# Altium schematic sheet HV_Detection.SchDoc
size A4; SheetNumber: 2; SheetTotal: 4
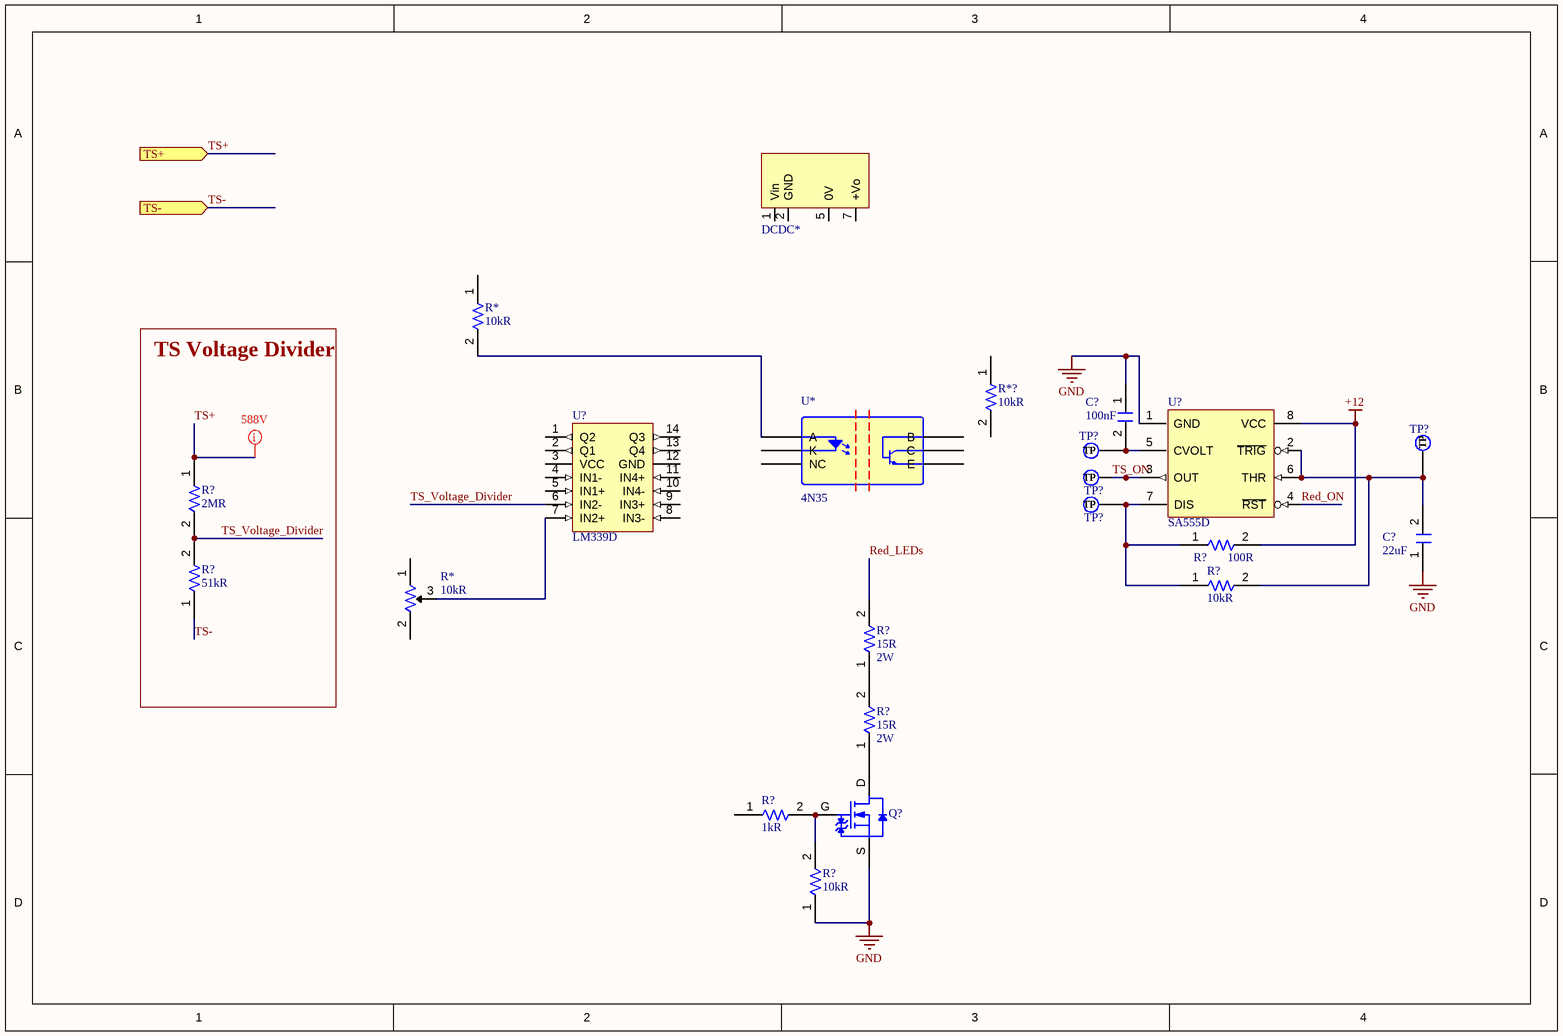
[diagram p0: HV_Detection.SchDoc]

## Parts
(Parts that share a designator on the sheet are numbered #1, #2 ... from top to bottom, then left to right.)
C?#1  Capacitance: 100nF  [C0805FNPC-R]  (hidden comment: 885012207098)
C?#2  Capacitance: 22uF  [C0805FNPC-W]  (hidden comment: 885012107011)
DCDC*  F1205S-1W  (value not drawn)
Q?  IRFR3410PbF  [TRT-NCH-D2PAK]  (value not drawn)
R*#1  Resistance: 10kR  [R1206FTK-W]  (hidden comment: CRCW120610K0FKEA)
R*#2  Resistance: 10kR  [R10k-VTR]  (hidden comment: 3296W-1-103LF)
R*?  Resistance: 10kR  [R1206FTK-W]  (hidden comment: CRCW120610K0FKEA)
R?#1  Resistance: 2MR  [R2512FTK]  (hidden comment: R2M-2512FTK)
R?#2  Resistance: 100R  [R0805FTK]  (hidden comment: CR0805-FX-1000ELF)
R?#3  Resistance: 10kR  [R0805FTK]  (hidden comment: CR0805-JW-103ELF)
R?#4  Resistance: 51kR  [R1206FTK-W]  (hidden comment: CRCW120610K0FKEA)
R?#5  value 15R  Max Power Dissipation: 2W  [R2512FTK]  (hidden comment: 352115RFT)
R?#6  value 15R  Max Power Dissipation: 2W  [R2512FTK]  (hidden comment: 352115RFT)
R?#7  Resistance: 1kR  [R0805FTK]  (hidden comment: CR0805-JW-102ELF)
R?#8  Resistance: 10kR  [R0805FTK]  (hidden comment: CR0805-JW-103ELF)
TP?#1  TestPoint  [TestPoint]  (value not drawn)  (no BOM)
TP?#2  TestPoint  [TestPoint]  (value not drawn)  (no BOM)
TP?#3  TestPoint  [TestPoint]  (value not drawn)  (no BOM)
TP?#4  TestPoint  [TestPoint]  (value not drawn)  (no BOM)
U*  4N35  [Optocoupler_4N35]
U?#1  LM339D  [Array_4_Amp_LM339D]
U?#2  Manufacturer Part Number: SA555D  [Timer_SA555]  (hidden comment: SA555)

## Blocks framed on the sheet
TS Voltage Divider: R?#1 R?#4

## Ports
TS+ (in), TS- (in)

## Nets
+12: R?#2.2 U?#2.8(VCC)
GND: C?#1.1 C?#2.1 Q?.S R?#8.1 U?#2.1(GND)
Red_LEDs: R?#5.2
Red_ON: U?#2.4(~{RST})
TS+: R?#1.1 ; port TS+
TS-: R?#4.1 ; port TS-
TS_ON: TP?#2.1(TP) U?#2.3(OUT)
TS_Voltage_Divider: R?#1.2 R?#4.2 U?#1.6(IN2-)
NetC?#1_2: C?#1.2 TP?#1.1(TP) U?#2.5(CVOLT)
NetC?#2_2: C?#2.2 R?#3.2 TP?#3.1(TP) U?#2.2(~{TRIG}) U?#2.6(THR)
NetQ?_D: Q?.D R?#6.1
NetQ?_G: Q?.G R?#7.2 R?#8.2
NetR*#1_2: R*#1.2 U*.1(A)
NetR*#2_3: R*#2.3 U?#1.7(IN2+)
NetR?#2_1: R?#2.1 R?#3.1 TP?#4.1(TP) U?#2.7(DIS)
NetR?#5_1: R?#5.1 R?#6.2

Not connected (* = marked no-connect by the designer): DCDC* 1(Vin) 2(GND) 5(0V) 7(+Vo); R*#1 1; R*#2 1(2) 2; R*? 1 2; R?#7 1; U* 2(K) 3(NC) 4(E) 5(C) 6(B); U?#1 1(Q2) 2(Q1) 3(VCC) 4(IN1-) 5(IN1+) 8(IN3-) 9(IN3+) 10(IN4-) 11(IN4+) 12(GND) 13(Q4) 14(Q3)

## Layout directives
mark named 588V: TS+

## Library data of the parts
C?#1 = C100n-50V-0805FNPC-X7R: Cap, 0.1ΜF, 50V, 10%, X7R, 0805; Manufacturer 1: Wurth Electronics; .Creator: DR; Supplier 1: RSComponents; Manufacturer Part Number 1: 885012207098; RoHS: Yes; Category: Ceramic Capacitors; Stock 1: 8000; Pricing 1: 100=0,10200, 500=0,07100, 2000=0,06100 (GBP); Mount: Surface Mount; Case/Package: 0805; Case Code (Metric): 2012; Case Code (Imperial): 0805; Min Operating Temperature: -55°C; Max Operating Temperature: 125°C; Packaging: Cut Tape; Voltage Rating: 50V; Dielectric: X7R; Tolerance: 10%; Voltage Rating (DC): 50V; Length: 0.079inch; Width: 0.049inch; Thickness: 0.035inch; REACH SVHC: Unknown; RoHS Compliant: Yes; ComponentLink1URL: http://www.farnell.com/datasheets/1958498.pdf?src-supplier=Farnell; ComponentLink1Description: http://www.farnell.com/datasheets/1958498.pdf?src-supplier=Farnell; ComponentLink2URL: http://www.farnell.com/datasheets/1958498.pdf?src-supplier=Element14; ComponentLink2Description: http://www.farnell.com/datasheets/1958498.pdf?src-supplier=Element14; ComponentLink3URL: https://katalog.we-online.de/pbs/datasheet/885012207098.pdf?src-supplier=Digi-Key; ComponentLink3Description: https://katalog.we-online.de/pbs/datasheet/885012207098.pdf?src-supplier=Digi-Key; ComponentLink4URL: http://www.farnell.com/datasheets/1958498.pdf?src-supplier=Newark; ComponentLink4Description: http://www.farnell.com/datasheets/1958498.pdf?src-supplier=Newark; Supplier Part Number 1: 1813493
C?#2 = C22u-10V-0805FNPC-X5R: Multilayer Ceramic Capacitor, Wcap-Csgp Series, 22 F, 20%, X5R, 10 V, 0805 [2012 Metric] Rohs Compliant: Yes; Manufacturer: Wurth Electronics; Voltage Rating: 10V; .Creator: DR; Supplier 1: RSComponents; Manufacturer Part Number: 885012107011; RoHS: Yes; Category: Ceramic Capacitors; Stock 1: 8800; Pricing 1: 20=0,15300, 100=0,40300, 200=0,37700, 500=0,35100, 1000=0,31700 (GBP); Mount: Surface Mount; Case/Package: 0805; Case Code (Metric): 2012; Case Code (Imperial): 0805; Min Operating Temperature: -55°C; Max Operating Temperature: 85°C; Packaging: Cut Tape; Dielectric: X5R; Tolerance: 20%; Voltage Rating (DC): 10V; Length: 0.079inch; Width: 0.049inch; Thickness: 0.057inch; REACH SVHC: Unknown; RoHS Compliant: Yes; ComponentLink1URL: http://www.farnell.com/datasheets/1958453.pdf?src-supplier=Farnell; ComponentLink1Description: http://www.farnell.com/datasheets/1958453.pdf?src-supplier=Farnell; ComponentLink2URL: http://www.farnell.com/datasheets/1958453.pdf?src-supplier=Newark; ComponentLink2Description: http://www.farnell.com/datasheets/1958453.pdf?src-supplier=Newark; ComponentLink3URL: http://www.farnell.com/datasheets/1958453.pdf?src-supplier=Element14; ComponentLink3Description: http://www.farnell.com/datasheets/1958453.pdf?src-supplier=Element14; ComponentLink4URL: https://katalog.we-online.de/pbs/datasheet/885012107011.pdf?src-supplier=Digi-Key; ComponentLink4Description: https://katalog.we-online.de/pbs/datasheet/885012107011.pdf?src-supplier=Digi-Key; Supplier Part Number 1: 1813507; ComponentLink5Description: Where buy it; ComponentLink5URL: https://www.we-online.com/catalog/en/WCAP-CSGP-10VDC#885012107011
DCDC* = DCDC-12V/5V-0.2A: 1W DCDC Converter 12V/5V, 3kVDC/1min, / SIP Package, -40°C to +85°C
Q? = TRT-NCH-31/100: MOSFET N-CH 100V 31A DPAK; Manufacturer 1: Infineon; Manufacturer Part Number 1: IRFR3410TRPBF; Power Dissipation: 110W; Gate to Source Voltage (Vgs): 20V; Rds On Max: 39mR; Input Capacitance: 1.69nF; Max Power Dissipation: 3W; Turn-Off Delay Time: 40ns; Turn-On Delay Time: 12ns; Threshold Voltage: 4V; Polarization: N; ComponentLink2Description: Datasheet; ComponentLink2URL: https://www.mouser.es/datasheet/2/427/sq2318bes-1868475.pdf; Supplier 1: Farnell; RoHS: Yes; Category: MOSFETs; Stock 1: 4070; Pricing 1: 1=1,20000, 10=1,08000, 100=0,84200, 500=0,69600 (EUR); Mount: Surface Mount; Case/Package: TO-252-3; Number of Pins: 3; Min Operating Temperature: -55°C; Max Operating Temperature: 175°C; Continuous Drain Current (ID): 31A; Packaging: Cut Tape; Drain to Source Voltage (Vdss): 100V; Drain to Source Resistance: 39mR; Drain to Source Breakdown Voltage: 100V; Series: HEXFET®; Max Dual Supply Voltage: 100V; Length: 0.264inch; Width: 0.245inch; Height: 0.094inch; Lead Free: Contains Lead; RoHS Compliant: Yes; Reach SVHC Compliant: Yes; Halogen Free: Halogen Free; Supplier Part Number 1: 2468036
R*#1 R*? = R10k-1206FTK: Res Thick Film 1206 10K Ohm 1% 0.25W(1/4W) +/-100ppm/ßC Pad SMD Automotive T/R; Temperature Coefficient: 100ppm/°C; Voltage Rating: 200V; .Creator: GP; Category: Resistor; ComponentLink1Description: Datasheet; ComponentLink1URL: https://docs.rs-online.com/bca8/A700000006404581.pdf; ComponentLink2Description: Where buy it; ComponentLink2URL: https://es.rs-online.com/web/p/resistencias-de-montaje-en-superficie/6791765; Supplier 1: Allied Electronics; Case/Package: 1206; Number of Pins: 2; Contact Plating: Tin; Weight: 0.000353oz; Case Code (Metric): 3216; Case Code (Imperial): 1206; Package Shape: Rectangular; Size Code: 1206; Terminal Finish: Tin; Resistor Type: Thick Film; Package Quantity: 10; Number of Terminations: 2; Termination: SMD/SMT; Voltage Rating (DC): 200V; Features: Automotive AEC-Q200; Series: CRCW; Construction: Rectangular; Resistance Tolerance: 1%; Working Voltage: 200V; Length: 3.2mm; Width: 0.063inch; Height: 0.55mm; Depth: 1.6mm; Radiation Hardening: No; Lead Free: Lead Free; RoHS Compliant: Yes; REACH SVHC: Unknown; Military Standard: Not; Supplier Part Number 1: 70201262
R*#2 = R10k-VTR: Trimmer, Cermet, Rest 10 Kilohms, PCB, 25 Turns, Pwr-Rtg 0.5W, 3296 Series; Manufacturer: Bourns; Tolerance: 10%; Power Rating: 500mW; Number of Turns: 25; Temperature Coefficient: 100ppm/°C; Insulation Resistance: 1GR; .Creator: DO; Supplier 1: RSComponents; Manufacturer Part Number: 3296W-1-103LF; RoHS: Yes; Category: Variable Resistors and Potentiometers; Stock 1: 3300; Pricing 1: 50=2,54800, 100=2,31900, 200=2,14000, 300=1,88400, 500=1,55300 (USD); Mount: PCB,Through Hole; Weight: 0.03oz; Color: Blue; Contact Plating: Tin,Matte; Min Operating Temperature: -55°C; Max Operating Temperature: 125°C; Packaging: Rail/Tube; Package Quantity: 50; Termination: Pin; Resistor Type: Cermet; Technology: CERMET; Taper: Linear; Max Power Dissipation: 500mW; Series: 3296; Resistance Tolerance: 10%; Length: 9.53mm; Width: 9.53mm; Height: 0.395inch; Depth: 4.83mm; Radiation Hardening: No; REACH SVHC: No SVHC; Military Standard: Not; Lead Free: Lead Free; RoHS Compliant: Yes; ComponentLink1URL: https://datasheet.ciiva.com/19454/853572-19454866.pdf?src-supplier=Jameco; ComponentLink1Description: https://datasheet.ciiva.com/19454/853572-19454866.pdf?src-supplier=Jameco; ComponentLink2URL: https://datasheet.ciiva.com/11830/0900766b8069ccf4-11830871.pdf?src-supplier=RSComponents; ComponentLink2Description: https://datasheet.ciiva.com/11830/0900766b8069ccf4-11830871.pdf?src-supplier=RSComponents; ComponentLink3URL: https://datasheet.ciiva.com/29122/447277-da-01-en-trimmer-tht3296w-1-103lf-10k-0-5w-29122362.pdf?src-supplier=Conrad; ComponentLink3Description: https://datasheet.ciiva.com/29122/447277-da-01-en-trimmer-tht3296w-1-103lf-10k-0-5w-29122362.pdf?src-supplier=Conrad; ComponentLink4URL: https://datasheet.ciiva.com/26913/3296w-1-103lf-26913885.pdf?src-supplier=IIIC; ComponentLink4Description: https://datasheet.ciiva.com/26913/3296w-1-103lf-26913885.pdf?src-supplier=IIIC; ComponentLink5URL: https://datasheet.ciiva.com/1131/1815117-1131273.pdf?src-supplier=Element14; ComponentLink5Description: https://datasheet.ciiva.com/1131/1815117-1131273.pdf?src-supplier=Element14; ComponentLink6URL: https://datasheet.ciiva.com/18411/70153578-18411561.pdf?src-supplier=Allied+Electronics; ComponentLink6Description: https://datasheet.ciiva.com/18411/70153578-18411561.pdf?src-supplier=Allied+Electronics; ComponentLink7URL: https://datasheet.ciiva.com/3266/3296-3266187.pdf?src-supplier=Avnet; ComponentLink7Description: https://datasheet.ciiva.com/3266/3296-3266187.pdf?src-supplier=Avnet; ComponentLink8URL: https://datasheet.ciiva.com/30093/3296-30093899.pdf?src-supplier=Onlinecomponents.com; ComponentLink8Description: https://datasheet.ciiva.com/30093/3296-30093899.pdf?src-supplier=Onlinecomponents.com; ComponentLink9URL: https://datasheet.ciiva.com/2156/3296-2156893.pdf?src-supplier=Digi-Key; ComponentLink9Description: https://datasheet.ciiva.com/2156/3296-2156893.pdf?src-supplier=Digi-Key; ComponentLink10URL: https://datasheet.ciiva.com/14173/ew3296-dat-e-14173022.pdf?src-supplier=Distrelec; ComponentLink10Description: https://datasheet.ciiva.com/14173/ew3296-dat-e-14173022.pdf?src-supplier=Distrelec; Supplier Part Number 1: 1673377; ComponentLink11Description: Where buy it; ComponentLink11URL: https://es.rs-online.com/web/p/potenciometros-de-ajuste/5219647
R?#1 = R2M-2512FTK: Current Sense Resistors - SMD 3watts .002ohms 1%; Manufacturer: Vishay Dale; Manufacturer Part Number: WSLP25122L000FEA; Temperature Coefficient: 275ppm/°C; Power Rating: 3W; Supplier 1: Mouser; RoHS: Yes; Category: Chip SMD Resistors; Stock 1: 11994; Pricing 1: 1=1,07000, 10=1,07000, 50=1,07000, 100=1,07000, 1000=0,77100, 10000=0,75500 (USD); Mount: Surface Mount; Case/Package: 2512; Case Code (Imperial): 2512; Case Code (Metric): 6432; Weight: 0.001429oz; Size Code: 2512; Min Operating Temperature: -65°C; Max Operating Temperature: 170°C; Tolerance: 1%; Packaging: Tape and Reel; Resistor Type: Metal Strip; Package Quantity: 2000; Termination: SMD/SMT; Series: WSLP; Length: 6.4mm; Width: 3.2mm; Height: 0.635mm; RoHS Compliant: Yes; Lead Free: Lead Free; ComponentLink1URL: https://datasheet.ciiva.com/48527/wslp-48527354.pdf?src-supplier=Avnet; ComponentLink1Description: https://datasheet.ciiva.com/48527/wslp-48527354.pdf?src-supplier=Avnet; Supplier Part Number 1: 71-WSLP25122L000FEA
R?#2 = R100-0805FTK: Res Thick Film 0805 100 Ohm 1% 1/8W ±100ppm/°C Molded SMD SMD Paper Tape on Plastic Reel; Manufacturer 1: Bourns; Power Rating: 125mW; Voltage Rating: 150V; .Creator: DR; Supplier 1: Arrow Electronics; Manufacturer Part Number 1: CR0805-FX-1000ELF; RoHS: Yes; Category: Chip SMD Resistors; Stock 1: 49802; Pricing 1: 1=0,05840, 10=0,03430, 25=0,01780, 100=0,00750, 250=0,00560, 500=0,00490, 3000=0,00470 (USD); Mount: Surface Mount; Case/Package: 0805; Number of Pins: 2; Contact Plating: Tin; Case Code (Imperial): 0805; Case Code (Metric): 2012; Min Operating Temperature: -55°C; Max Operating Temperature: 155°C; Tolerance: 1%; Resistor Type: Thick Film; Temperature Coefficient: 100ppm/°C; Packaging: Tape and Reel; Package Quantity: 1; Termination: SMD/SMT; Number of Terminations: 2; Max Power Dissipation: 125mW; Voltage Rating (DC): 150V; Features: Moisture Resistant; Series: CR0805; Resistance Tolerance: 1%; Construction: Rectangular; Technology: THICK FILM; Length: 2mm; Width: 1.25mm; Height: 0.5mm; Depth: 1.25mm; Thickness: 508um; Radiation Hardening: No; REACH SVHC: No SVHC; Military Standard: Not; RoHS Compliant: Yes; ComponentLink1URL: https://datasheet.ciiva.com/11809/0900766b80fcdb72-11809178.pdf?src-supplier=RSComponents; ComponentLink1Description: https://datasheet.ciiva.com/11809/0900766b80fcdb72-11809178.pdf?src-supplier=RSComponents; ComponentLink2URL: https://datasheet.ciiva.com/6547/chpreztr-6547413.pdf?src-supplier=Digi-Key; ComponentLink2Description: https://datasheet.ciiva.com/6547/chpreztr-6547413.pdf?src-supplier=Digi-Key; ComponentLink3URL: https://datasheet.ciiva.com/6547/chpreztr-6547414.pdf?src-supplier=Digi-Key; ComponentLink3Description: https://datasheet.ciiva.com/6547/chpreztr-6547414.pdf?src-supplier=Digi-Key; ComponentLink4URL: https://datasheet.ciiva.com/6547/chpreztr-6547415.pdf?src-supplier=Digi-Key; ComponentLink4Description: https://datasheet.ciiva.com/6547/chpreztr-6547415.pdf?src-supplier=Digi-Key; ComponentLink5URL: https://datasheet.ciiva.com/9120/chpreztr-9120744.pdf?src-supplier=Avnet; ComponentLink5Description: https://datasheet.ciiva.com/9120/chpreztr-9120744.pdf?src-supplier=Avnet; Supplier Part Number 1: CR0805-FX-1000ELF
R?#3 R?#8 = R10k-0805FTK: BOURNS         CR0805-JW-103ELF            Surface Mount Chip Resistor, Thick Film, CR Series, 10 kohm, 125 mW,  5%, 150 V; Temperature Coefficient: 200ppm/°C; Power Rating: 125mW; Voltage Rating: 150V; Voltage Rating (DC): 100V; .Creator: DR; Supplier 1: Arrow Electronics; Manufacturer 1: Bourns; Manufacturer Part Number 1: CR0805-JW-103ELF; RoHS: Yes; Category: Chip SMD Resistors; Stock 1: 57566; Pricing 1: 1=0,05790, 10=0,01540, 25=0,01340, 100=0,00340 (USD); Mount: Surface Mount; Case/Package: 0805; Number of Pins: 2; Contact Plating: Tin; Case Code (Metric): 2012; Case Code (Imperial): 0805; Min Operating Temperature: -55°C; Max Operating Temperature: 155°C; Tolerance: 5%; Resistor Type: Thick Film; Package Quantity: 1; Packaging: Tape and Reel; Number of Terminations: 2; Termination: SMD/SMT; Max Power Dissipation: 125mW; Features: Moisture Resistant; Series: CR0805; Construction: Rectangular; Resistance Tolerance: 5%; Technology: THICK FILM; Length: 2mm; Width: 1.25mm; Height: 0.5mm; Depth: 1.25mm; Thickness: 508um; Radiation Hardening: No; REACH SVHC: No SVHC; Military Standard: Not; RoHS Compliant: Yes; ComponentLink1URL: https://datasheet.ciiva.com/11821/0900766b80fcdb72-11821135.pdf?src-supplier=RSComponents; ComponentLink1Description: https://datasheet.ciiva.com/11821/0900766b80fcdb72-11821135.pdf?src-supplier=RSComponents; ComponentLink2URL: https://datasheet.ciiva.com/9122/chpreztr-9122374.pdf?src-supplier=Avnet; ComponentLink2Description: https://datasheet.ciiva.com/9122/chpreztr-9122374.pdf?src-supplier=Avnet; ComponentLink3URL: https://datasheet.ciiva.com/22693/1902866-22693254.pdf?src-supplier=Element14; ComponentLink3Description: https://datasheet.ciiva.com/22693/1902866-22693254.pdf?src-supplier=Element14; ComponentLink4URL: https://datasheet.ciiva.com/7986/691949-7986187.pdf?src-supplier=Element14; ComponentLink4Description: https://datasheet.ciiva.com/7986/691949-7986187.pdf?src-supplier=Element14; ComponentLink5URL: https://datasheet.ciiva.com/30065/159chpreztr-30065976.pdf?src-supplier=Onlinecomponents.com; ComponentLink5Description: https://datasheet.ciiva.com/30065/159chpreztr-30065976.pdf?src-supplier=Onlinecomponents.com; ComponentLink6URL: https://datasheet.ciiva.com/16783/70154685-16783482.pdf?src-supplier=Allied+Electronics; ComponentLink6Description: https://datasheet.ciiva.com/16783/70154685-16783482.pdf?src-supplier=Allied+Electronics; ComponentLink7URL: https://datasheet.ciiva.com/5548/chpreztr-5548491.pdf?src-supplier=Mouser; ComponentLink7Description: https://datasheet.ciiva.com/5548/chpreztr-5548491.pdf?src-supplier=Mouser; ComponentLink8URL: https://datasheet.ciiva.com/6559/chpreztr-6559900.pdf?src-supplier=Digi-Key; ComponentLink8Description: https://datasheet.ciiva.com/6559/chpreztr-6559900.pdf?src-supplier=Digi-Key; ComponentLink9URL: https://datasheet.ciiva.com/6559/chpreztr-6559901.pdf?src-supplier=Digi-Key; ComponentLink9Description: https://datasheet.ciiva.com/6559/chpreztr-6559901.pdf?src-supplier=Digi-Key; ComponentLink10URL: https://datasheet.ciiva.com/7985/1856384-7985869.pdf?src-supplier=Element14; ComponentLink10Description: https://datasheet.ciiva.com/7985/1856384-7985869.pdf?src-supplier=Element14; ComponentLink11URL: https://datasheet.ciiva.com/48692/001055517-da-01-en-smd-wid-cr0805-jw-103elf-10k-ohm-1-8w-48692118.pdf?src-supplier=Conrad; ComponentLink11Description: https://datasheet.ciiva.com/48692/001055517-da-01-en-smd-wid-cr0805-jw-103elf-10k-ohm-1-8w-48692118.pdf?src-supplier=Conrad; Supplier Part Number 1: CR0805-JW-103ELF
R?#4 = R51k-1206FTK: Res Thick Film 1206 51K Ohm 1% 1/4W ±100ppm/°C Molded SMD SMD Punched Carrier T/R; Manufacturer: Panasonic; Manufacturer Part Number: ERJ-S08F5102V; Power Rating: 250mW; Voltage Rating: 150V; Voltage Rating (DC): 200V; Current Rating: 2A; .Creator: DO; Category: Resistor; ComponentLink1Description: Datasheet; ComponentLink1URL: https://docs.rs-online.com/bca8/A700000006404581.pdf; ComponentLink2Description: Where buy it; ComponentLink2URL: https://es.rs-online.com/web/p/resistencias-de-montaje-en-superficie/6791765; Supplier 1: Mouser; RoHS: Yes; Stock 1: 4091; Pricing 1: 1=0,31000, 10=0,26700, 50=0,26700, 100=0,10700, 1000=0,05100, 10000=0,03400 (USD); Mount: Surface Mount; Case/Package: 1206; Case Code (Metric): 3216; Case Code (Imperial): 1206; Contact Plating: Tin; Min Operating Temperature: -55°C; Max Operating Temperature: 155°C; Packaging: Tape and Reel; Tolerance: 1%; Package Quantity: 5000; Resistor Type: Thick Film; Number of Terminations: 2; Temperature Coefficient: 100ppm/°C; Max Power Dissipation: 250mW; Features: Anti-Sulfur; Series: ERJ; Construction: Rectangular; Length: 3.2mm; Width: 0.063inch; Height: 0.028inch; Depth: 1.6mm; Military Standard: Not; Lead Free: Lead Free; RoHS Compliant: Yes; ComponentLink3URL: https://datasheet.ciiva.com/24023/aoa0000ce5-24023518.pdf?src-supplier=Mouser; ComponentLink3Description: https://datasheet.ciiva.com/24023/aoa0000ce5-24023518.pdf?src-supplier=Mouser; ComponentLink4URL: https://datasheet.ciiva.com/9189/aoa0000ce5-9189211.pdf?src-supplier=Avnet; ComponentLink4Description: https://datasheet.ciiva.com/9189/aoa0000ce5-9189211.pdf?src-supplier=Avnet; Supplier Part Number 1: 667-ERJ-S08F5102V
R?#5 R?#6 = R15-2512FTK: Res Thick Film 2512 15 Ohm 1% 2W ±100ppm/C Pad SMD T/R; Manufacturer 1: TE Connectivity; Temperature Coefficient: 100ppm/°C; Voltage Rating: 250V; Number of Resistors: 1; .Creator: DR; ComponentLink1Description: Datasheet; ComponentLink1URL: https://docs.rs-online.com/8bc1/0900766b81096b90.pdf; ComponentLink2Description: Where buy it; ComponentLink2URL: https://es.rs-online.com/web/p/resistencias-de-montaje-en-superficie/7551110; Supplier 1: RSComponents; Manufacturer Part Number 1: 352115RFT; RoHS: Yes; Category: Chip SMD Resistors; Stock 1: 1; Pricing 1: 10=0,64300, 250=0,62200, 1000=0,60000, 2000=0,55400, 2500=0,52100 (USD); Mount: Surface Mount; Case/Package: 2512; Case Code (Metric): 6432; Case Code (Imperial): 2512; Min Operating Temperature: -55°C; Max Operating Temperature: 155°C; Packaging: Tape and Reel; Tolerance: 1%; Resistor Type: Thick Film,Power resistor; Number of Terminations: 2; Termination: Solder; Voltage Rating (DC): 250V; Features: Automotive AEC-Q200; Series: 3521, CGS; Technology: THICK FILM; Resistance Tolerance: 1%; Length: 6.3mm; Height: 0.55mm; Depth: 3.2mm; RoHS Compliant: Yes; REACH SVHC: No SVHC; ELV: Compliant; ComponentLink3URL: https://datasheet.ciiva.com/25610/0900766b81096b90-25610033.pdf?src-supplier=RSComponents; ComponentLink3Description: https://datasheet.ciiva.com/25610/0900766b81096b90-25610033.pdf?src-supplier=RSComponents; ComponentLink4URL: https://datasheet.ciiva.com/46391/1610601-46391493.pdf?src-supplier=Element14; ComponentLink4Description: https://datasheet.ciiva.com/46391/1610601-46391493.pdf?src-supplier=Element14; ComponentLink5URL: https://datasheet.ciiva.com/7657/1610601-7657542.pdf?src-supplier=Element14; ComponentLink5Description: https://datasheet.ciiva.com/7657/1610601-7657542.pdf?src-supplier=Element14; Supplier Part Number 1: 7551110P
R?#7 = R1k-0805FTK: Res Thick Film 0805 1K Ohm 5% 1/8W ±200ppm/°C Molded SMD SMD Paper Tape on Plastic Reel; Manufacturer 1: Bourns; Voltage Rating (DC): 150V; Power Rating: 125mW; .Creator: GP; Supplier 1: Arrow Electronics; Manufacturer Part Number 1: CR0805-JW-102ELF; RoHS: Yes; Category: Chip SMD Resistors; Stock 1: 27510; Pricing 1: 1=0,05930, 10=0,03510, 25=0,01790, 100=0,00800, 250=0,00790, 500=0,00590, 1000=0,00360, 3000=0,00350, 6000=0,00250 (USD); Mount: Surface Mount; Case/Package: 0805; Number of Pins: 2; Contact Plating: Tin; Case Code (Metric): 2012; Case Code (Imperial): 0805; Min Operating Temperature: -55°C; Max Operating Temperature: 155°C; Resistor Type: Thick Film; Tolerance: 5%; Temperature Coefficient: 200ppm/°C; Features: Moisture Resistant; Package Quantity: 1; Packaging: Tape and Reel; Voltage Rating: 150V; Number of Terminations: 2; Termination: SMD/SMT; Max Power Dissipation: 125mW; Length: 2mm; Width: 1.25mm; Height: 0.5mm; Thickness: 508um; Depth: 1.25mm; Radiation Hardening: No; Lead Free: Lead Free; REACH SVHC: No SVHC; Military Standard: Not; ComponentLink1URL: https://datasheet.ciiva.com/11821/0900766b80fcdb72-11821134.pdf?src-supplier=RSComponents; ComponentLink1Description: https://datasheet.ciiva.com/11821/0900766b80fcdb72-11821134.pdf?src-supplier=RSComponents; ComponentLink2URL: https://datasheet.ciiva.com/15225/getdatasheetpartid-78155-15225381.pdf?src-supplier=Verical; ComponentLink2Description: https://datasheet.ciiva.com/15225/getdatasheetpartid-78155-15225381.pdf?src-supplier=Verical; ComponentLink3URL: https://datasheet.ciiva.com/22693/1902866-22693253.pdf?src-supplier=Element14; ComponentLink3Description: https://datasheet.ciiva.com/22693/1902866-22693253.pdf?src-supplier=Element14; ComponentLink4URL: https://datasheet.ciiva.com/7986/1856384-7986184.pdf?src-supplier=Element14; ComponentLink4Description: https://datasheet.ciiva.com/7986/1856384-7986184.pdf?src-supplier=Element14; ComponentLink5URL: https://datasheet.ciiva.com/7985/1856384-7985867.pdf?src-supplier=Element14; ComponentLink5Description: https://datasheet.ciiva.com/7985/1856384-7985867.pdf?src-supplier=Element14; ComponentLink6URL: https://datasheet.ciiva.com/30242/159chpreztr-30242765.pdf?src-supplier=Onlinecomponents.com; ComponentLink6Description: https://datasheet.ciiva.com/30242/159chpreztr-30242765.pdf?src-supplier=Onlinecomponents.com; ComponentLink7URL: https://datasheet.ciiva.com/6547/chpreztr-6547359.pdf?src-supplier=Digi-Key; ComponentLink7Description: https://datasheet.ciiva.com/6547/chpreztr-6547359.pdf?src-supplier=Digi-Key; Supplier Part Number 1: CR0805-JW-102ELF
TP?#1-TP?#4 = TestPoint: Test Point 1x1 mm; .Creator: GP; Category: TestPoint; .PCBcheck: GP; .SCHcheck: GP
U* = Optocoupler_4N35: Optocoupler DC-IN 1-CH Transistor With Base DC-OUT 6-Pin PDIP SMD T/R; Manufacturer: Vishay Lite-On; Manufacturer Part Number: CNY17-4S-TA1; Number of Channels: 1; Max Power Dissipation: 250mW; Isolation Voltage: 5kV; Output Voltage: 70V; Forward Voltage: 1.65V; Rise Time: 10000ns; Collector Emitter Saturation Voltage: 300mV; Max Input Current: 60mA; Reverse Breakdown Voltage: 6V; Input Type: DC; Current Transfer Ratio: 320%; Output Current per Channel: 150mA; .Creator: DO; Supplier 1: RSComponents; RoHS: Yes; Category: Optocouplers; Stock 1: 1; Pricing 1: 50=0,27200, 250=0,25600, 500=0,24000, 1250=0,22500, 2500=0,21200 (USD); Mount: Surface Mount; Case/Package: SMD/SMT; Number of Pins: 6; Min Operating Temperature: -55°C; Max Operating Temperature: 100°C; Packaging: Tape and Reel; Package Quantity: 1000; Power Dissipation: 250mW; Collector Emitter Voltage (VCEO): 70V; Max Output Voltage: 70V; Number of Elements: 1; Series: -; Forward Current: 60mA; Collector-emitter Voltage-Max: 300mV; Fall Time: 10000ns; Number of Circuits: 1; Max Collector Current: 150mA; Radiation Hardening: No; Lead Free: Lead Free; RoHS Compliant: Yes; ComponentLink1URL: https://datasheet.ciiva.com/15118/getdatasheetpartid-187668-15118874.pdf?src-supplier=Verical; ComponentLink1Description: https://datasheet.ciiva.com/15118/getdatasheetpartid-187668-15118874.pdf?src-supplier=Verical; ComponentLink2URL: https://datasheet.ciiva.com/6573/s-110-cny17-6573733.pdf?src-supplier=Digi-Key; ComponentLink2Description: https://datasheet.ciiva.com/6573/s-110-cny17-6573733.pdf?src-supplier=Digi-Key; Supplier Part Number 1: 1278380P; ComponentLink3Description: Where buy it; ComponentLink3URL: https://es.rs-online.com/web/p/circuitos-integrados-optoacopladores/1257571
U?#1 = Array_4_Comp_LM339D: Comparator Quad ±18V/36V 14-Pin SOIC Tube; Manufacturer: Texas Instruments; Number of Channels: 4; Nominal Supply Current: 2mA; Output Current: 20mA; Quiescent Current: 2.5mA; Max Supply Voltage: 30V; Min Supply Voltage: 2V; Min Dual Supply Voltage: 1V; Max Dual Supply Voltage: 15V; Voltage Gain: 106.02dB; Max Supply Current: 500uA; Input Bias Current: 250nA; Output Current per Channel: 6mA; Input Offset Voltage (Vos): 5mV; Response Time: 0.3us; Output Type: TTL; Dual Supply Voltage: 9V; .Creator: DO; Supplier 1: Digi-Key; RoHS: Yes; Category: Amplifiers - Op Amps, Buffer, Instrumentation; Stock 1: 10834; Pricing 1: 1=0,93000, 10=0,83500, 25=0,79240, 100=0,65090, 250=0,60848, 500=0,53774, 1000=0,46725 (USD); Mount: Surface Mount; Case/Package: SOIC; Number of Pins: 14; Contact Plating: Gold; Weight: 0.004318oz; Min Operating Temperature: 0°C; Max Operating Temperature: 70°C; Packaging: Rail/Tube; Package Quantity: 50; Number of Elements: 4; Supply Current: 2mA; Technology: BIPOLAR; Max Input Current: 250nA; Series: LM339; Length: 8.65mm; Width: 3.91mm; Height: 1.58mm; Radiation Hardening: No; REACH SVHC: No SVHC; Lead Free: Lead Free; RoHS Compliant: Yes; ComponentLink1URL: https://datasheet.ciiva.com/15131/getdatasheetpartid-248452-15131099.pdf?src-supplier=Verical; ComponentLink1Description: https://datasheet.ciiva.com/15131/getdatasheetpartid-248452-15131099.pdf?src-supplier=Verical; ComponentLink2URL: https://datasheet.ciiva.com/1483/1831045-1483000.pdf?src-supplier=Element14; ComponentLink2Description: https://datasheet.ciiva.com/1483/1831045-1483000.pdf?src-supplier=Element14; ComponentLink3URL: https://datasheet.ciiva.com/1827/lm139a-1827534.pdf?src-supplier=Digi-Key; ComponentLink3Description: https://datasheet.ciiva.com/1827/lm139a-1827534.pdf?src-supplier=Digi-Key; ComponentLink4URL: https://datasheet.ciiva.com/2970/lm2901-2970484.pdf?src-supplier=Avnet; ComponentLink4Description: https://datasheet.ciiva.com/2970/lm2901-2970484.pdf?src-supplier=Avnet; ComponentLink5URL: https://datasheet.ciiva.com/48712/001010753-da-01-en-ic-quad-diff-comp-lm339d-soic-14-tid-48712470.pdf?src-supplier=Conrad; ComponentLink5Description: https://datasheet.ciiva.com/48712/001010753-da-01-en-ic-quad-diff-comp-lm339d-soic-14-tid-48712470.pdf?src-supplier=Conrad; Supplier Part Number 1: 296-1013-5-ND; ComponentLink6Description: Where buy it; ComponentLink6URL: https://es.rs-online.com/web/p/comparadores/0858411; Manufacturer Part Number: LM339D
U?#2 = Timer_SA555: Precision timer for -55 to 85C operation 8-SOIC -40 to 85; Manufacturer: Texas Instruments; Frequency: 500kHz; Min Supply Voltage: 4.5V; Max Supply Voltage: 16V; Number of Timers/Counters: 1; Operating Supply Current: 10mA; High Level Output Current: -200mA; Low Level Output Current: 200mA; Quiescent Current: 15mA; Nominal Supply Current: 2mA; .Creator: DO; Supplier 1: Digi-Key; RoHS: Yes; Category: Timers and Oscillators; Stock 1: 1162; Pricing 1: 1=0,93000, 10=0,83500, 25=0,79240, 100=0,65090, 250=0,60848, 500=0,53774, 1000=0,46725 (USD); Mount: Surface Mount; Case/Package: SOIC; Number of Pins: 8; Weight: 0.002561oz; Contact Plating: Gold; Min Operating Temperature: -40°C; Max Operating Temperature: 85°C; Packaging: Rail/Tube; Package Quantity: 75; Length: 4.9mm; Width: 3.91mm; Height: 1.58mm; Radiation Hardening: No; Lead Free: Lead Free; RoHS Compliant: Yes; REACH SVHC: No SVHC; ComponentLink1URL: https://datasheet.ciiva.com/1147/na555-1147816.pdf?src-supplier=Newark; ComponentLink1Description: https://datasheet.ciiva.com/1147/na555-1147816.pdf?src-supplier=Newark; ComponentLink2URL: https://datasheet.ciiva.com/14094/ne555-series-eng-tds-14094951.pdf?src-supplier=Distrelec; ComponentLink2Description: https://datasheet.ciiva.com/14094/ne555-series-eng-tds-14094951.pdf?src-supplier=Distrelec; ComponentLink3URL: https://datasheet.ciiva.com/1233/sa555-1233455.pdf?src-supplier=Digi-Key; ComponentLink3Description: https://datasheet.ciiva.com/1233/sa555-1233455.pdf?src-supplier=Digi-Key; ComponentLink4URL: https://datasheet.ciiva.com/1139/1851962-1139987.pdf?src-supplier=Element14; ComponentLink4Description: https://datasheet.ciiva.com/1139/1851962-1139987.pdf?src-supplier=Element14; ComponentLink5URL: https://datasheet.ciiva.com/15152/getdatasheetpartid-75292-15152565.pdf?src-supplier=Verical; ComponentLink5Description: https://datasheet.ciiva.com/15152/getdatasheetpartid-75292-15152565.pdf?src-supplier=Verical; Supplier Part Number 1: 296-9681-5-ND; ComponentLink6Description: Where buy it; ComponentLink6URL: https://www.mouser.es/ProductDetail/Texas-Instruments/SA555D?qs=gb35HGp1gQJkvy2FEVqR%2Fw%3D%3D